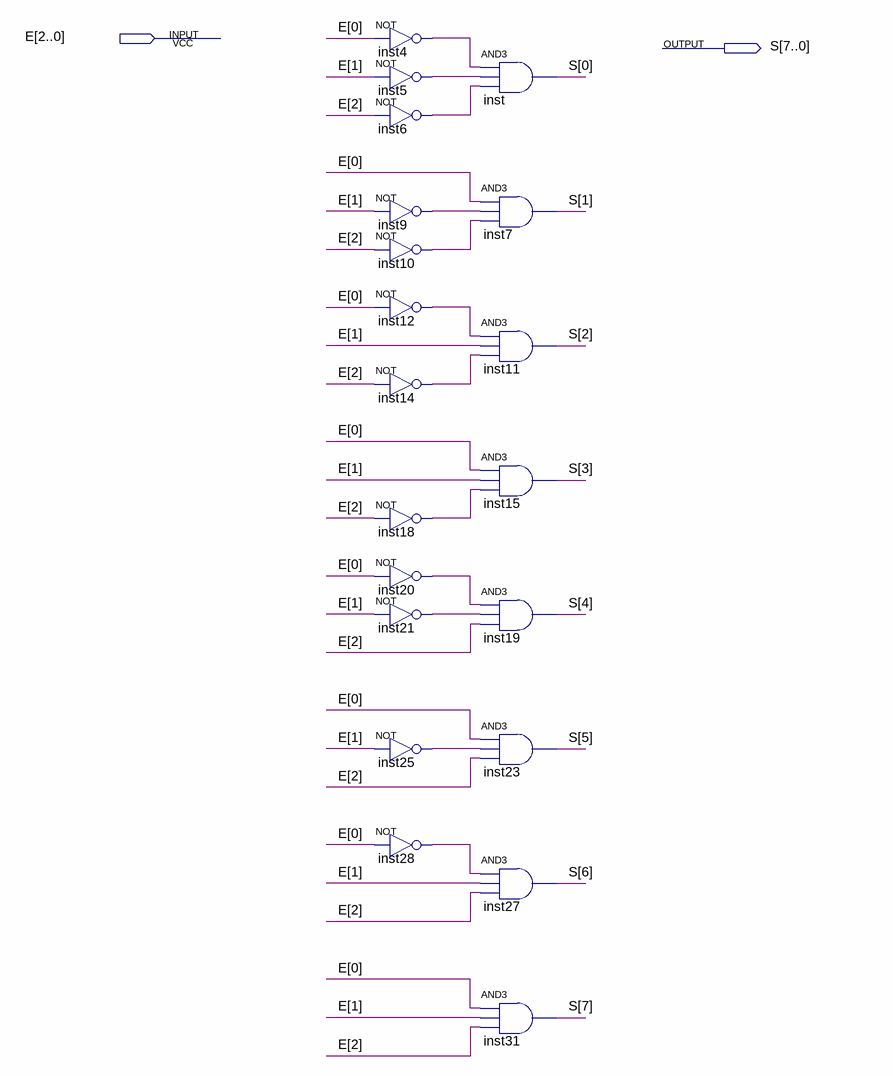
[diagram p0: schematic sheet]
// Quartus schematic decod.bdf as structural Verilog: 20 symbols, 2 pins
module decod (
  input  [2:0] E,
  output [7:0] S
);

  wire inst4_out, inst5_out, inst6_out, inst9_out, inst10_out, inst12_out, inst14_out, inst18_out,
       inst20_out, inst21_out, inst25_out, inst28_out;

  not inst4 (inst4_out, E[0]);
  not inst5 (inst5_out, E[1]);
  not inst6 (inst6_out, E[2]);
  not inst9 (inst9_out, E[1]);
  not inst10 (inst10_out, E[2]);
  not inst12 (inst12_out, E[0]);
  not inst14 (inst14_out, E[2]);
  not inst18 (inst18_out, E[2]);
  not inst20 (inst20_out, E[0]);
  not inst21 (inst21_out, E[1]);
  not inst25 (inst25_out, E[1]);
  not inst28 (inst28_out, E[0]);
  and inst (S[0], inst4_out, inst5_out, inst6_out);
  and inst7 (S[1], E[0], inst9_out, inst10_out);
  and inst11 (S[2], inst12_out, E[1], inst14_out);
  and inst15 (S[3], E[0], E[1], inst18_out);
  and inst19 (S[4], inst20_out, inst21_out, E[2]);
  and inst23 (S[5], E[0], inst25_out, E[2]);
  and inst27 (S[6], inst28_out, E[1], E[2]);
  and inst31 (S[7], E[0], E[1], E[2]);
endmodule
